# Altium schematic sheet ads1299.SchDoc
size A3
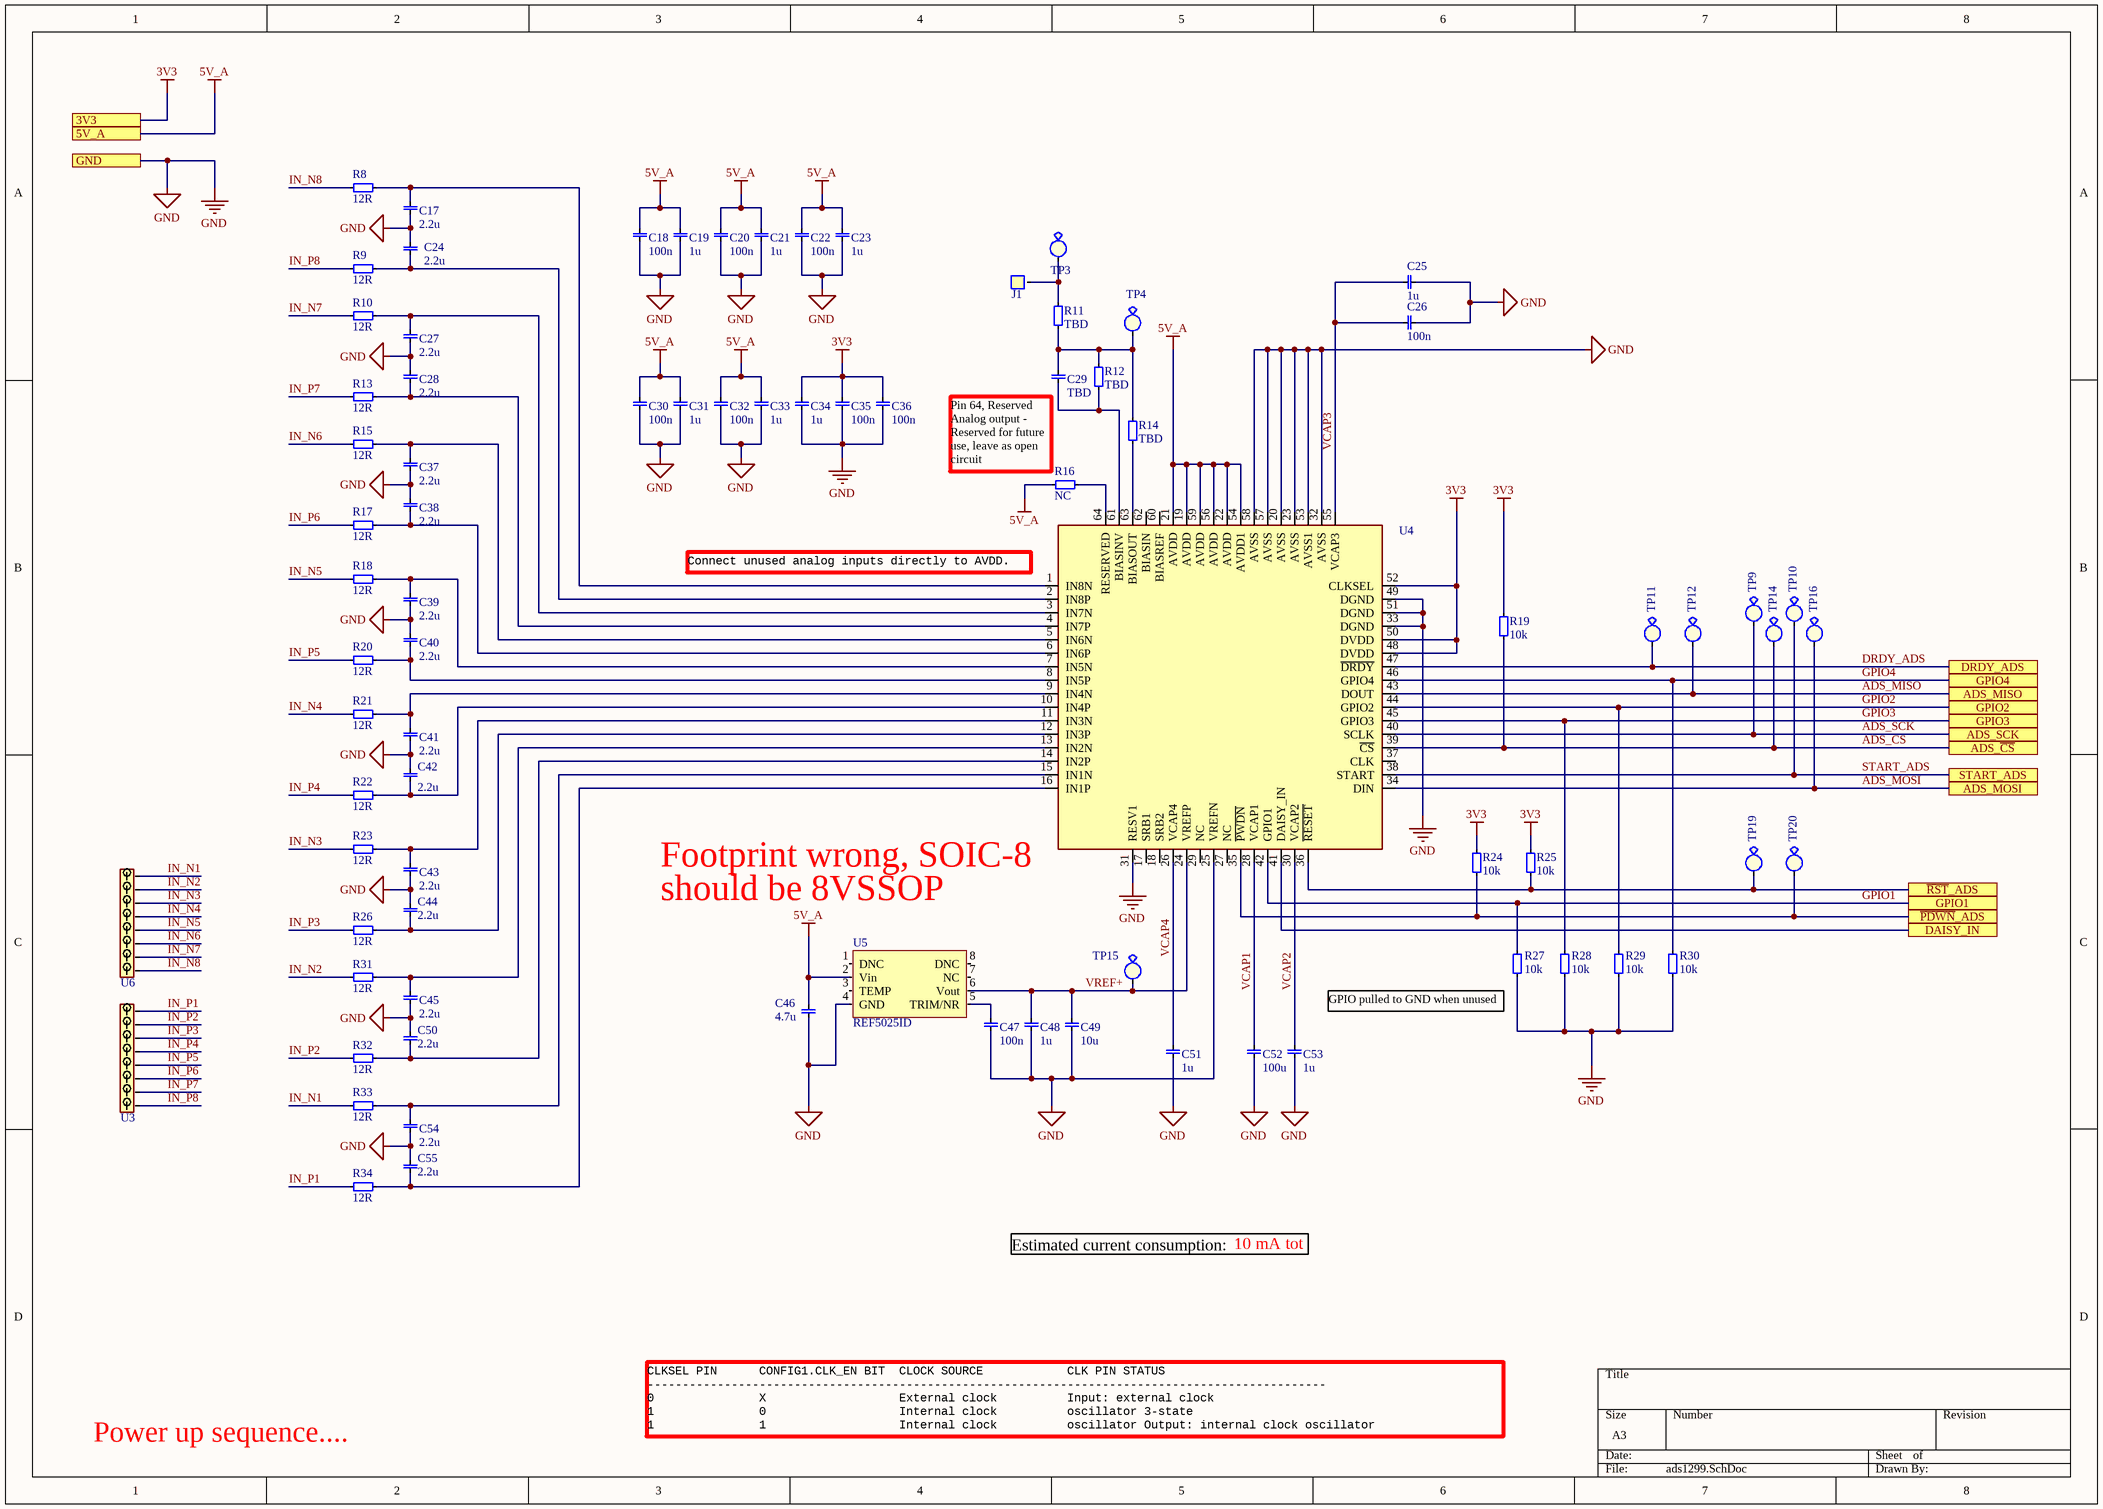
[diagram p0: ads1299.SchDoc]

## Parts
C17  value 2.2u  [0402 CAP]  (hidden comment: 0603, capacitor)
C18  value 100n  [0402 CAP]  (hidden comment: 0603, capacitor)
C19  value 1u  [0402 CAP]  (hidden comment: 0603, capacitor)
C20  value 100n  [0402 CAP]  (hidden comment: 0603, capacitor)
C21  value 1u  [0402 CAP]  (hidden comment: 0603, capacitor)
C22  value 100n  [0402 CAP]  (hidden comment: 0603, capacitor)
C23  value 1u  [0402 CAP]  (hidden comment: 0603, capacitor)
C24  value 2.2u  [0402 CAP]  (hidden comment: 0603, capacitor)
C25  value 1u  [0402 CAP]  (hidden comment: 0603, capacitor)
C26  value 100n  [0402 CAP]  (hidden comment: 0603, capacitor)
C27  value 2.2u  [0402 CAP]  (hidden comment: 0603, capacitor)
C28  value 2.2u  [0402 CAP]  (hidden comment: 0603, capacitor)
C29  value TBD  [0402 CAP]  (hidden comment: 0603, capacitor)
C30  value 100n  [0402 CAP]  (hidden comment: 0603, capacitor)
C31  value 1u  [0402 CAP]  (hidden comment: 0603, capacitor)
C32  value 100n  [0402 CAP]  (hidden comment: 0603, capacitor)
C33  value 1u  [0402 CAP]  (hidden comment: 0603, capacitor)
C34  value 1u  [0402 CAP]  (hidden comment: 0603, capacitor)
C35  value 100n  [0402 CAP]  (hidden comment: 0603, capacitor)
C36  value 100n  [0402 CAP]  (hidden comment: 0603, capacitor)
C37  value 2.2u  [0402 CAP]  (hidden comment: 0603, capacitor)
C38  value 2.2u  [0402 CAP]  (hidden comment: 0603, capacitor)
C39  value 2.2u  [0402 CAP]  (hidden comment: 0603, capacitor)
C40  value 2.2u  [0402 CAP]  (hidden comment: 0603, capacitor)
C41  value 2.2u  [0402 CAP]  (hidden comment: 0603, capacitor)
C42  value 2.2u  [0402 CAP]  (hidden comment: 0603, capacitor)
C43  value 2.2u  [0402 CAP]  (hidden comment: 0603, capacitor)
C44  value 2.2u  [0402 CAP]  (hidden comment: 0603, capacitor)
C45  value 2.2u  [0402 CAP]  (hidden comment: 0603, capacitor)
C46  value 4.7u  [0402 CAP]  (hidden comment: 0603, capacitor)
C47  value 100n  [0402 CAP]  (hidden comment: 0603, capacitor)
C48  value 1u  [0402 CAP]  (hidden comment: 0603, capacitor)
C49  value 10u  [0402 CAP]  (hidden comment: 0603, capacitor)
C50  value 2.2u  [0402 CAP]  (hidden comment: 0603, capacitor)
C51  value 1u  [0402 CAP]  (hidden comment: 0603, capacitor)
C52  value 100u  [1210, cap]  (hidden comment: 1210, capacitor)
C53  value 1u  [0402 CAP]  (hidden comment: 0603, capacitor)
C54  value 2.2u  [0402 CAP]  (hidden comment: 0603, capacitor)
C55  value 2.2u  [0402 CAP]  (hidden comment: 0603, capacitor)
J1  1x1 Mini binding post  [1_pin_binding_post]  (value not drawn)
R8  value 12R  [0402 res]  (hidden comment: 0603, resistor)
R9  value 12R  [0402 res]  (hidden comment: 0603, resistor)
R10  value 12R  [0402 res]  (hidden comment: 0603, resistor)
R11  value TBD  [0402 res]  (hidden comment: 0603, resistor)
R12  value TBD  [0402 res]  (hidden comment: 0603, resistor)
R13  value 12R  [0402 res]  (hidden comment: 0603, resistor)
R14  value TBD  [0402 res]  (hidden comment: 0603, resistor)
R15  value 12R  [0402 res]  (hidden comment: 0603, resistor)
R16  value NC  [0402 res]  (hidden comment: 0603, resistor)
R17  value 12R  [0402 res]  (hidden comment: 0603, resistor)
R18  value 12R  [0402 res]  (hidden comment: 0603, resistor)
R19  value 10k  [0402 res]  (hidden comment: 0603, resistor)
R20  value 12R  [0402 res]  (hidden comment: 0603, resistor)
R21  value 12R  [0402 res]  (hidden comment: 0603, resistor)
R22  value 12R  [0402 res]  (hidden comment: 0603, resistor)
R23  value 12R  [0402 res]  (hidden comment: 0603, resistor)
R24  value 10k  [0402 res]  (hidden comment: 0603, resistor)
R25  value 10k  [0402 res]  (hidden comment: 0603, resistor)
R26  value 12R  [0402 res]  (hidden comment: 0603, resistor)
R27  value 10k  [0402 res]  (hidden comment: 0603, resistor)
R28  value 10k  [0402 res]  (hidden comment: 0603, resistor)
R29  value 10k  [0402 res]  (hidden comment: 0603, resistor)
R30  value 10k  [0402 res]  (hidden comment: 0603, resistor)
R31  value 12R  [0402 res]  (hidden comment: 0603, resistor)
R32  value 12R  [0402 res]  (hidden comment: 0603, resistor)
R33  value 12R  [0402 res]  (hidden comment: 0603, resistor)
R34  value 12R  [0402 res]  (hidden comment: 0603, resistor)
TP3  Test Point  [TESTPOINT_SMD]  (value not drawn)
TP4  Test Point  [TESTPOINT_SMD]  (value not drawn)
TP9  Test Point  [TESTPOINT_SMD]  (value not drawn)
TP10  Test Point  [TESTPOINT_SMD]  (value not drawn)
TP11  Test Point  [TESTPOINT_SMD]  (value not drawn)
TP12  Test Point  [TESTPOINT_SMD]  (value not drawn)
TP14  Test Point  [TESTPOINT_SMD]  (value not drawn)
TP15  Test Point  [TESTPOINT_SMD]  (value not drawn)
TP16  Test Point  [TESTPOINT_SMD]  (value not drawn)
TP19  Test Point  [TESTPOINT_SMD]  (value not drawn)
TP20  Test Point  [TESTPOINT_SMD]  (value not drawn)
U3  1x8 Screw terminal  [screw_term_8_pos]  (value not drawn)
U4  ADS1299  [TQFP64_05MM_P]  (value not drawn)
U5  REF5025ID  [SOP65P490X110-8N]
U6  1x8 Screw terminal  [screw_term_8_pos]  (value not drawn)

## Ports
3V3, 5V_A, ADS_MISO, ADS_MOSI, ADS_SCK, ADS_~{CS}, DAISY_IN, DRDY_ADS, GND, GPIO1, GPIO2, GPIO3, GPIO4, START_ADS, ~{PDWN}_ADS, ~{RST}_ADS

## Nets
3V3: C34.1 C35.1 C36.1 R19.0 R24.0 R25.0 U4.48(DVDD) U4.50(DVDD) U4.52(CLKSEL) ; port 3V3
5V_A: C18.1 C19.1 C20.1 C21.1 C22.1 C23.1 C30.1 C31.1 C32.1 C33.1 C46.1 R16.0 U4.19(AVDD) U4.21(AVDD) U4.22(AVDD) U4.54(AVDD1) U4.56(AVDD) U4.59(AVDD) U5.2(Vin) ; port 5V_A
GND: C17.0 C18.0 C19.0 C20.0 C21.0 C22.0 C23.0 C24.0 C25.0 C26.0 C27.0 C28.0 C30.0 C31.0 C32.0 C33.0 C34.0 C35.0 C36.0 C37.0 C38.0 C39.0 C40.0 C41.0 C42.0 C43.0 C44.0 C45.0 C46.0 C47.0 C48.0 C49.0 C50.0 C51.0 C52.0 C53.0 C54.0 C55.0 R27.1 R28.1 R29.1 R30.1 U4.20(AVSS) U4.23(AVSS) U4.25(VREFN) U4.31(RESV1) U4.32(AVSS) U4.33(DGND) U4.49(DGND) U4.51(DGND) U4.53(AVSS1) U4.57(AVSS) U4.58(AVSS) U5.4(GND) ; port GND
ADS_~{CS}: R19.1 TP14.0 U4.39(~{CS}) ; port ADS_~{CS}
ADS_MISO: TP12.0 U4.43(DOUT) ; port ADS_MISO
ADS_MOSI: TP16.0 U4.34(DIN) ; port ADS_MOSI
ADS_SCK: TP9.0 U4.40(SCLK) ; port ADS_SCK
DAISY_IN: U4.41(DAISY_IN) ; port DAISY_IN
DRDY_ADS: TP11.0 U4.47(~{DRDY}) ; port DRDY_ADS
GPIO1: R27.0 U4.42(GPIO1) ; port GPIO1
GPIO2: R29.0 U4.44(GPIO2) ; port GPIO2
GPIO3: R28.0 U4.45(GPIO3) ; port GPIO3
GPIO4: R30.0 U4.46(GPIO4) ; port GPIO4
IN_N1: R33.1 U6.1
IN_N2: R31.1 U6.2
IN_N3: R23.1 U6.3
IN_N4: R21.1 U6.4
IN_N5: R18.1 U6.5
IN_N6: R15.1 U6.6
IN_N7: R10.1 U6.7
IN_N8: R8.1 U6.8
IN_P1: R34.1 U3.8
IN_P2: R32.1 U3.7
IN_P3: R26.1 U3.6
IN_P4: R22.1 U3.5
IN_P5: R20.1 U3.4
IN_P6: R17.1 U3.3
IN_P7: R13.1 U3.2
IN_P8: R9.1 U3.1
~{PDWN}_ADS: R24.1 TP20.0 U4.35(~{PWDN}) ; port ~{PDWN}_ADS
~{RST}_ADS: R25.1 TP19.0 U4.36(~{RESET}) ; port ~{RST}_ADS
START_ADS: TP10.0 U4.38(START) ; port START_ADS
VCAP1: C52.1 U4.28(VCAP1)
VCAP2: C53.1 U4.30(VCAP2)
VCAP3: C25.1 C26.1 U4.55(VCAP3)
VCAP4: C51.1 U4.26(VCAP4)
VREF+: C48.1 C49.1 TP15.0 U4.24(VREFP) U5.6(Vout)
NetC17_1: C17.1 R8.0 U4.1(IN8N)
NetC24_1: C24.1 R9.0 U4.2(IN8P)
NetC27_1: C27.1 R10.0 U4.3(IN7N)
NetC28_1: C28.1 R13.0 U4.4(IN7P)
NetC29_0: C29.0 R12.1 U4.61(BIASINV)
NetC29_1: C29.1 R11.1 R12.0 R14.0 TP4.0
NetC37_1: C37.1 R15.0 U4.5(IN6N)
NetC38_1: C38.1 R17.0 U4.6(IN6P)
NetC39_1: C39.1 R18.0 U4.7(IN5N)
NetC40_1: C40.1 R20.0 U4.8(IN5P)
NetC41_1: C41.1 R21.0 U4.9(IN4N)
NetC42_1: C42.1 R22.0 U4.10(IN4P)
NetC43_1: C43.1 R23.0 U4.11(IN3N)
NetC44_1: C44.1 R26.0 U4.12(IN3P)
NetC45_1: C45.1 R31.0 U4.13(IN2N)
NetC47_1: C47.1 U5.5(TRIM/NR)
NetC50_1: C50.1 R32.0 U4.14(IN2P)
NetC54_1: C54.1 R33.0 U4.15(IN1N)
NetC55_1: C55.1 R34.0 U4.16(IN1P)
NetJ1_1: J1.1 R11.0 TP3.0
NetR14_1: R14.1 U4.63(BIASOUT)
NetR16_1: R16.1 U4.64(RESERVED)

Not connected (* = marked no-connect by the designer): U4 17(SRB1) 18(SRB2) 27(NC) 29(NC) 37(CLK) 60(BIASREF) 62(BIASIN); U5 1(DNC) 3(TEMP) 7(NC) 8(DNC)

## Notes on the sheet
- Pin 64, Reserved Analog output - Reserved for future use, leave as open circuit
- (near U4) Connect unused analog inputs directly to AVDD.
- (near U4) Footprint wrong, SOIC-8
- should be 8VSSOP
- (near R27) GPIO pulled to GND when unused
- Estimated current consumption:
- 10 mA tot
- Power up sequence....
- CLKSEL PIN      CONFIG1.CLK_EN BIT  CLOCK SOURCE            CLK PIN STATUS
  -------------------------------------------------------------------------------------------------
  0               X                   External clock          Input: external clock
  1               0                   Internal clock          oscillator 3-state
  1               1                   Internal clock          oscillator Output: internal clock oscillator

## Library data of the parts
C17 C24 C27 C28 C37-C45 C50 C54 C55 = 0603, capacitor: Manufacturer Part No: GRM155D71A225ME15D
C18 C20 C22 C26 C30 C32 C35 C36 C47 = 0603, capacitor: Manufacturer Part No: GRM155R62A104KE14D
C19 C21 C23 C25 C31 C33 C34 C48 C51 C53 = 0603, capacitor: Manufacturer Part No: CL05A105KO5NNNC
C46 = 0603, capacitor: Manufacturer Part No: 04023U4R7CAT2A
C49 = 0603, capacitor: Manufacturer Part No: GRM155R61A106ME11D
C52 = 1210, capacitor: Manufacturer Part No: EMK325ABJ107MM-T
J1 = 1x1 Mini binding post: 1 Pin Binding Post M2.5 Through Hole; Manufacturer Part No: 8730; Value: 1x3 Pin Header
R8-R10 R13 R15 R17 R18 R20-R23 R26 R31-R34 = 0603, resistor: Manufacturer Part No: RC0402FR-0712RL
R19 R24 R25 R27-R30 = 0603, resistor: Manufacturer Part No: 311-10.0KLRCT-ND
U3 U6 = 1x8 Screw terminal: Manufacturer Part No: OSTVN08A150
U4 = ADS1299: 24-Bit, Analog-to-Digital Converter for EEG and / Biopotential Measurements; Manufacturer Part No: ADS1299IPAG
TP3 TP4 TP9-TP12 TP14-TP16 TP19 TP20 = Test Point: Value: Test point; Farnell: 1702006
U5 = REF5025ID: Value: REF5025ID; Farnell: 1702829; Manufacturer Part No: REF5025ID